# EasyEDA Pro project remo-v0.8.0-rc2-a.epro, schematic Schematic1_5

## Sheets
1 main: Board Name: tf_mux-v1.0.1-a; Create Date: 2025-06-03; Page Name: main; Project Name: sd_mux; Schematic Name: Schematic1_5; Update Date: 2025-06-04; Company: 嘉立创EDA; Page Size: A4; Version: V1.0
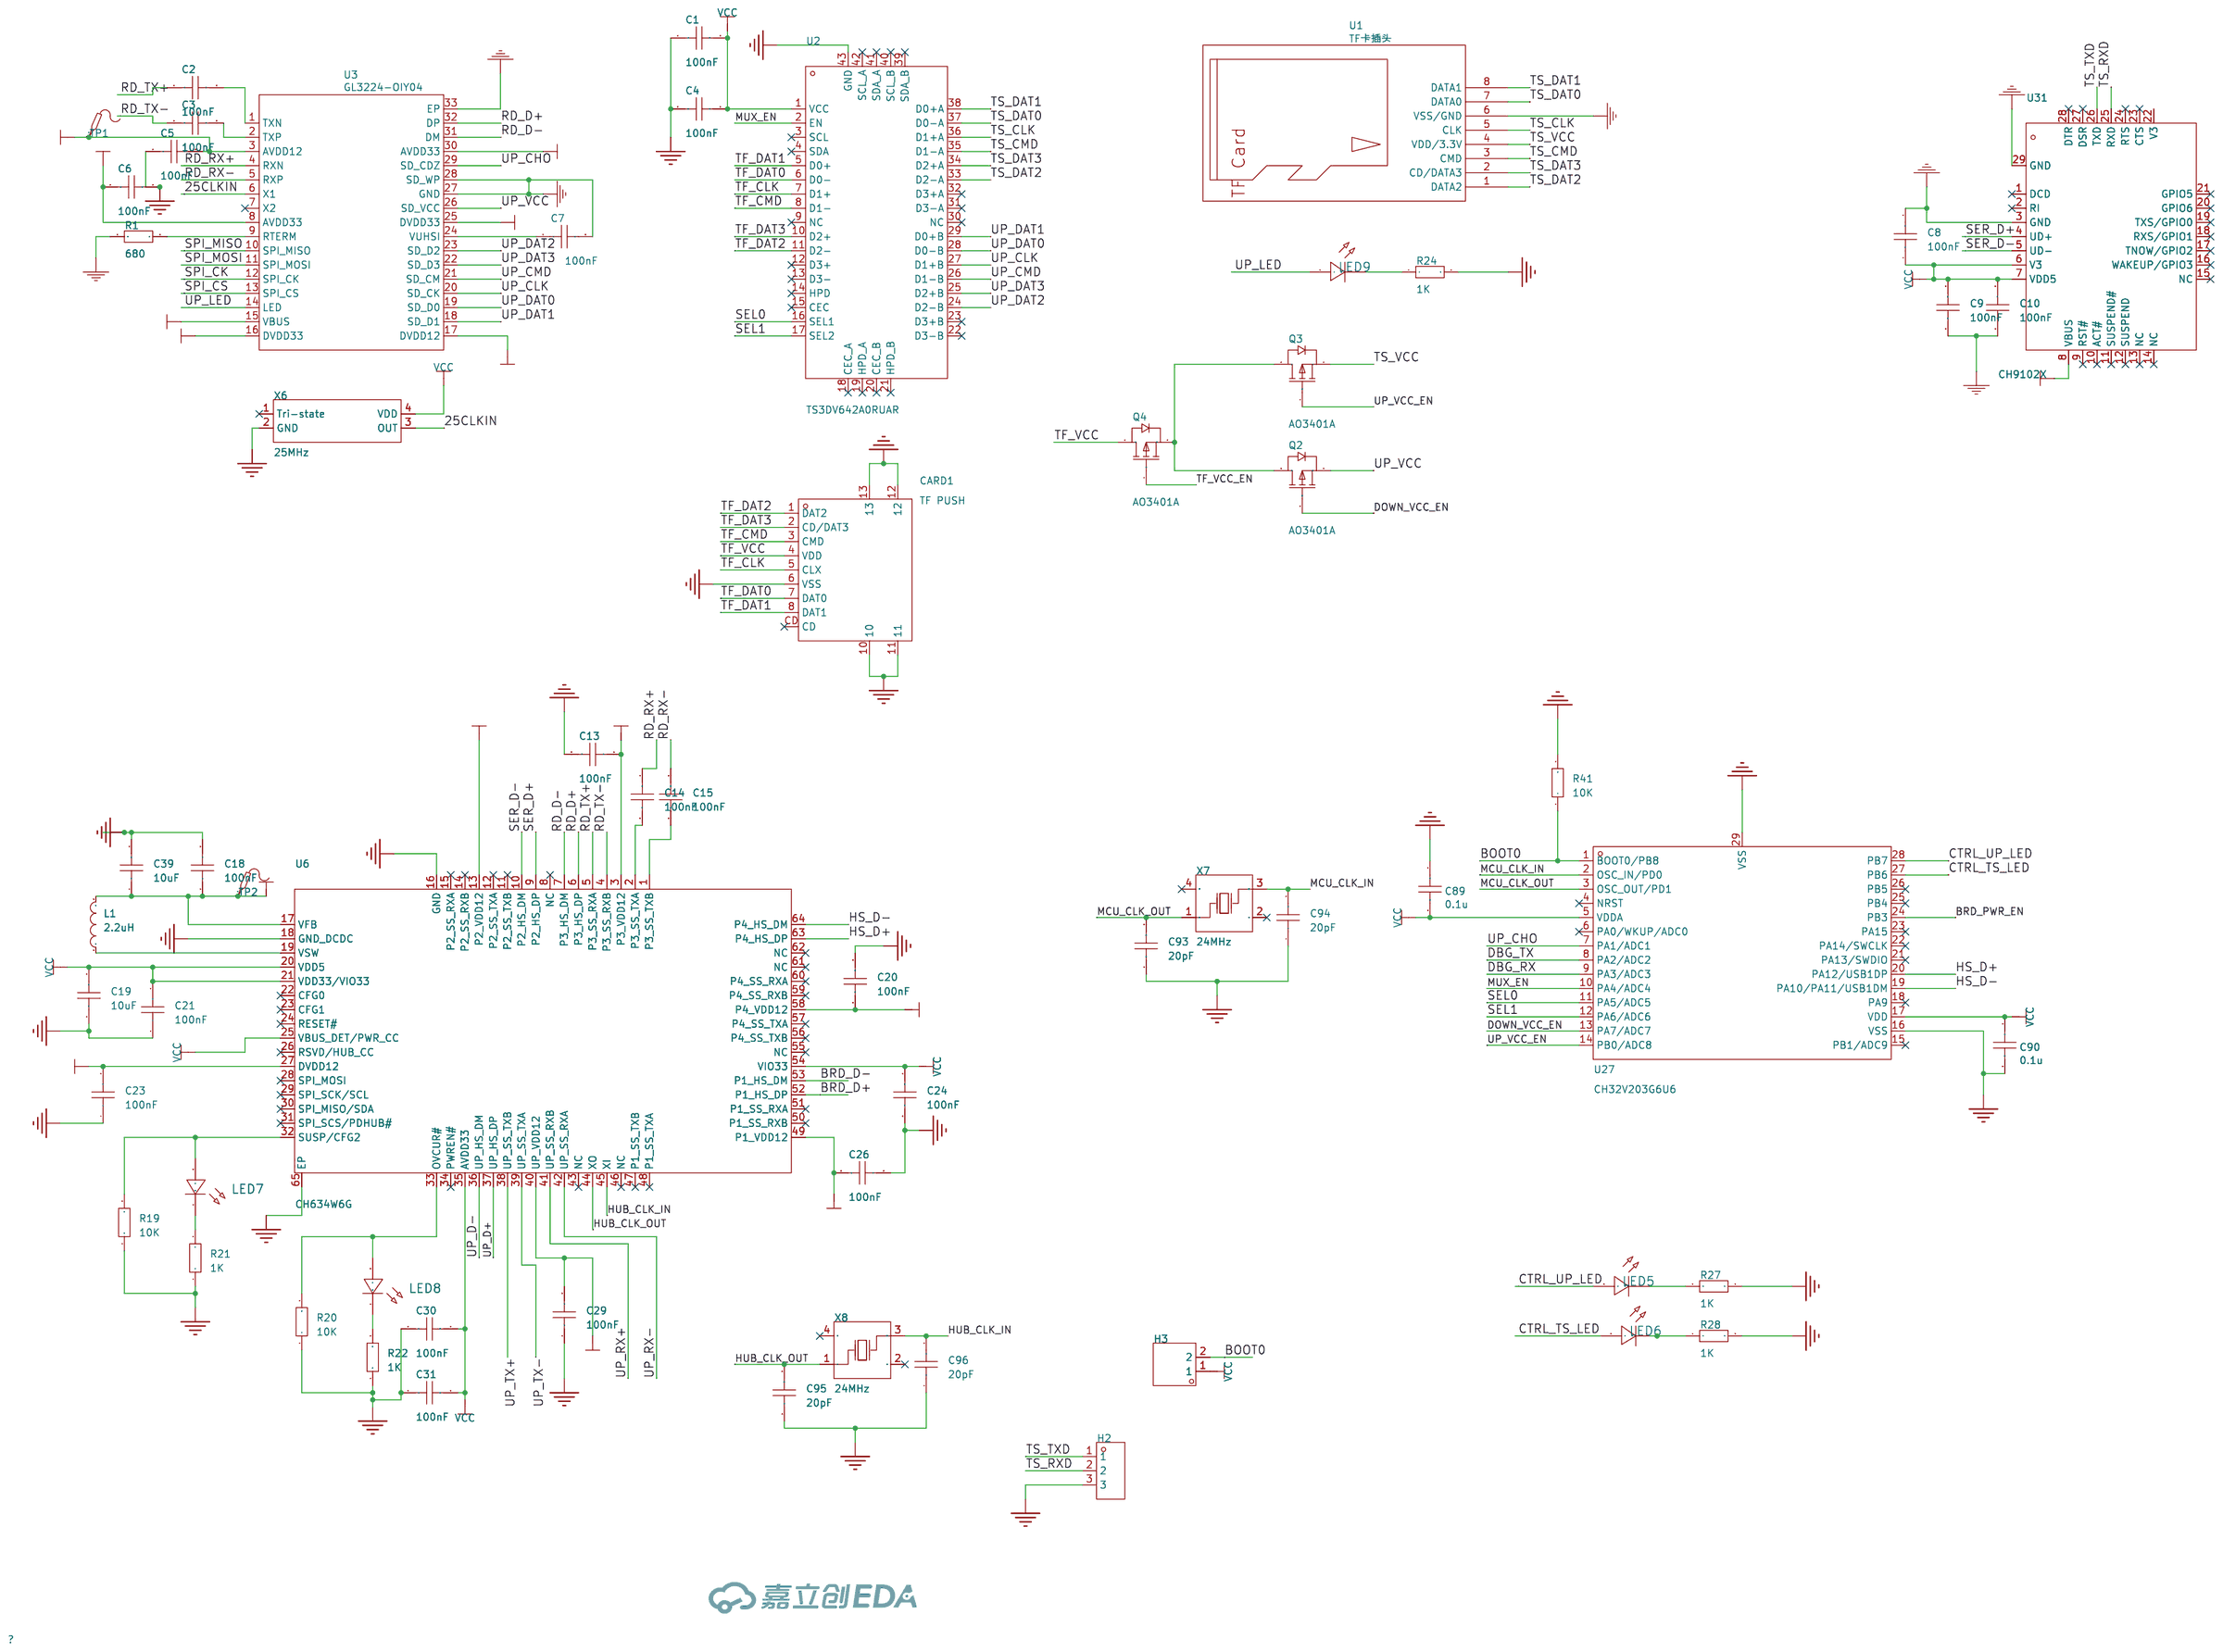
[diagram p0: main]
2 typec_pwr: Board Name: TF_MUX_v1.0.0-a; Create Date: 2025-05-07; Page Name: typec_pwr; Schematic Name: Schematic1_3; Update Date: 2025-05-07
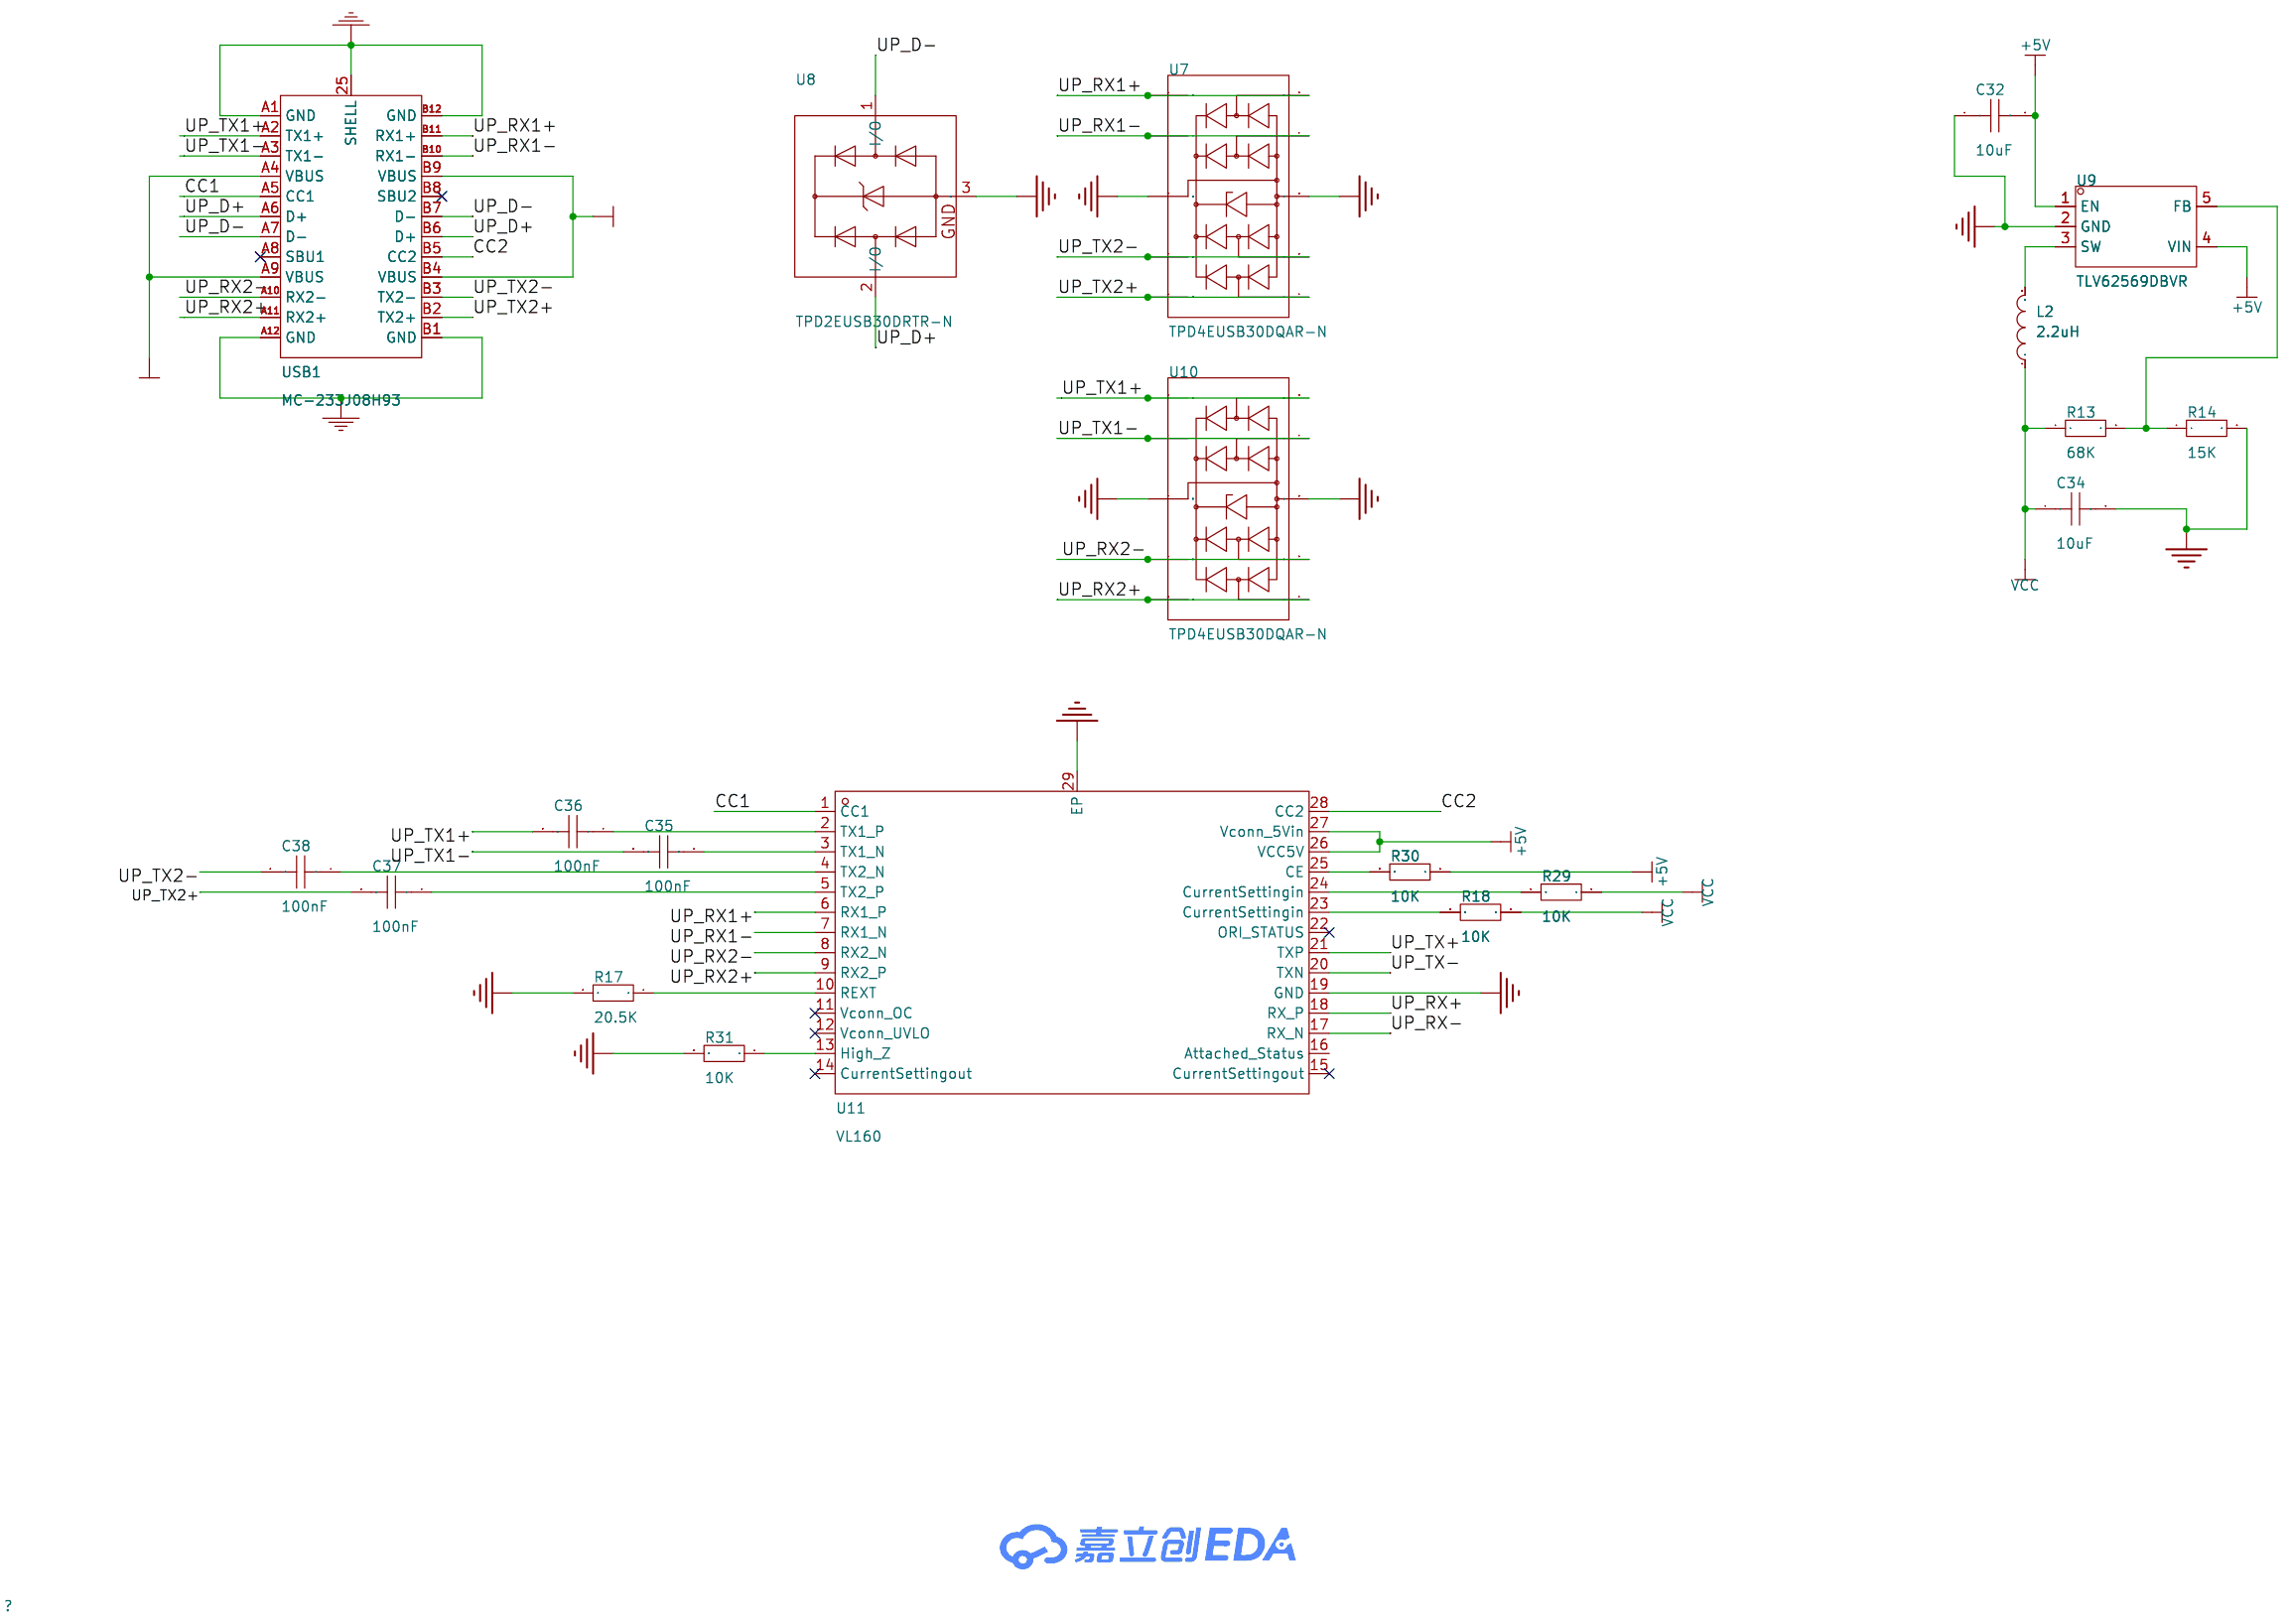
[diagram p1: typec_pwr]
3 power_ctrl: Create Date: 2025-06-05; Page Name: power_ctrl; Update Date: 2025-06-05
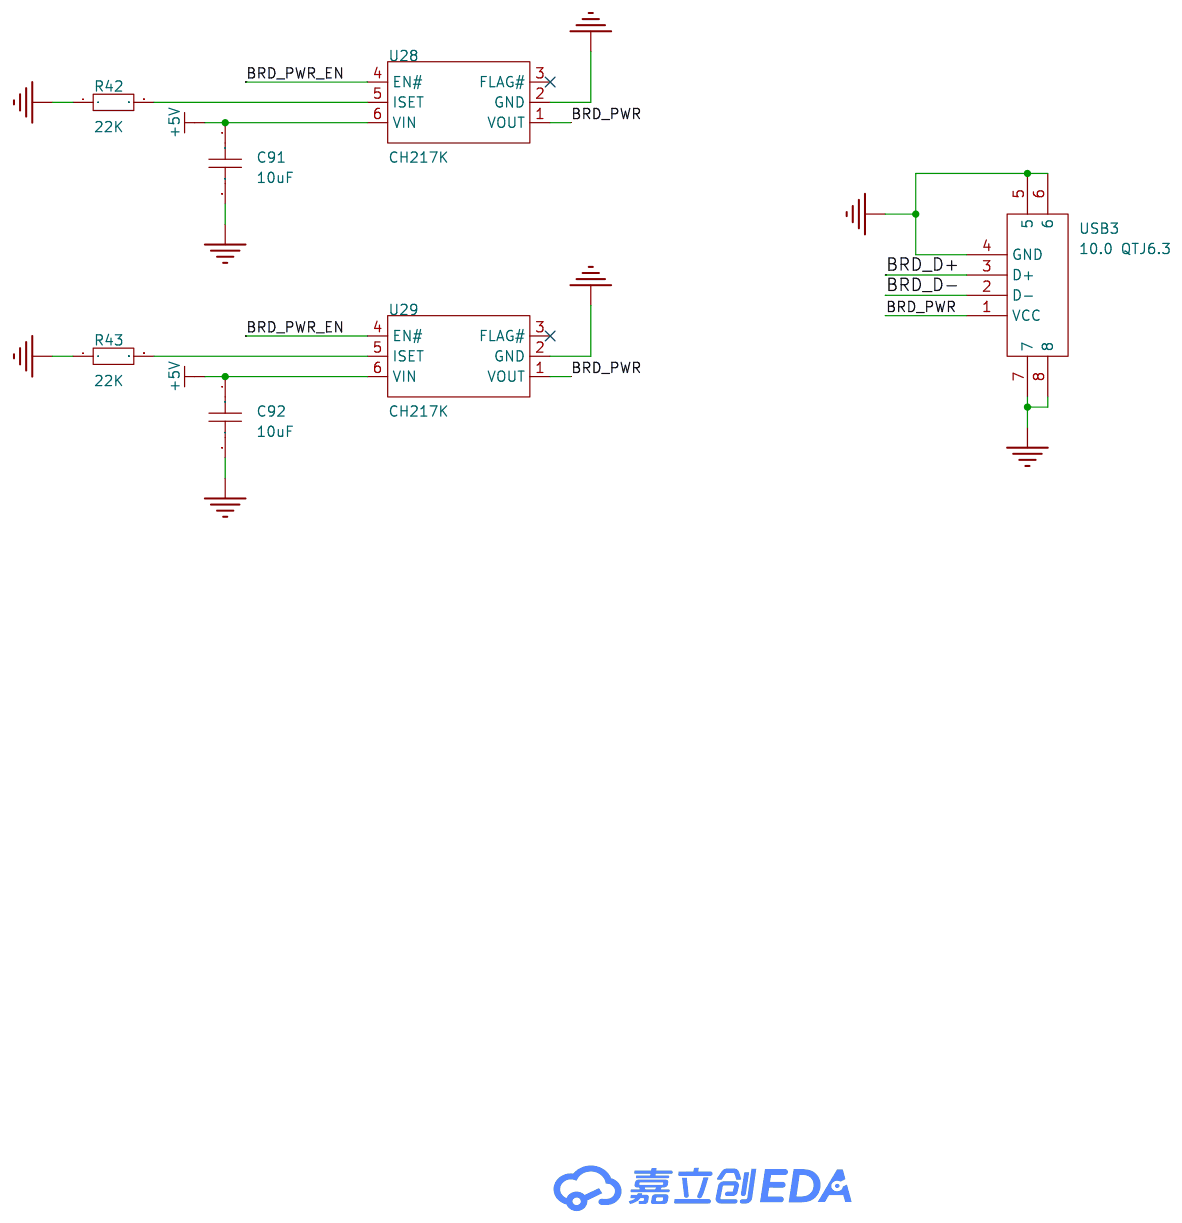
[diagram p2: power_ctrl]

## Parts
sheet main
C1  100nF  [C0402]
C2  100nF  [C0402]
C3  100nF  [C0402]
C4  100nF  [C0402]
C5  100nF  [C0402]
C6  100nF  [C0402]
C7  100nF  [C0402]
C8  100nF  [C0402]
C9  100nF  [C0402]
C10  100nF  [C0402]
C13  100nF  [C0402]
C14  100nF  [C0402]
C15  100nF  [C0402]
C18  100nF  [C0402]
C19  10uF  [C0402]
C20  100nF  [C0402]
C21  100nF  [C0402]
C23  100nF  [C0402]
C24  100nF  [C0402]
C26  100nF  [C0402]
C29  100nF  [C0402]
C30  100nF  [C0402]
C31  100nF  [C0402]
C39  10uF  [C0402]
C89  0.1u  [C0402]
C90  0.1u  [C0402]
C93  20pF  [C0402]
C94  20pF  [C0402]
C95  20pF  [C0402]
C96  20pF  [C0402]
CARD1  TF PUSH  [TF-SMD_TF-PUSH]
H2  -  [HDR-TH_3P-P2.54-V-M]  (no BOM)
H3  -  [HDR-TH_2P-P2.54-V-M-1]  (no BOM)
L1  2.2uH  [IND-SMD_L2.5-W2.0_MHCHL2520]
LED5  -  [LED_0603]
LED6  -  [LED_0603]
LED7  -  [LED_0603]
LED8  -  [LED_0603]
LED9  -  [LED_0603]
Q2  AO3401A  [SOT-23_L2.9-W1.3-P1.90-LS2.4-BR]
Q3  AO3401A  [SOT-23_L2.9-W1.3-P1.90-LS2.4-BR]
Q4  AO3401A  [SOT-23_L2.9-W1.3-P1.90-LS2.4-BR]
R1  680  [R0603]
R19  10K  [R0402]
R20  10K  [R0402]
R21  1K  [R0402]
R22  1K  [R0402]
R24  1K  [R0402]
R27  1K  [R0402]
R28  1K  [R0402]
R41  10K  [R0603]
TP1  -  [Test-Point-0.5mm]
TP2  -  [Test-Point-0.5mm]
U1  TF卡插头  [TF卡封装]  (no BOM)
U2  TS3DV642A0RUAR  [WFQFN-42_L9.0-W3.5-P0.50-BL-EP]
U3  GL3224-OIY04  [HQFN-32_L5.0-W5.0-P0.50-BL-EP3.0]
U6  CH634W6G  [QFN-64_L8.0-W8.0-P0.40-TL-EP6.2]
U27  CH32V203G6U6  [QFN-28_L4.0-W4.0-P0.40-BL-EP2.7]
U31  CH9102X  [TQFN-28_L5.0-W5.0-P0.50-BL-EP2.7]
X6  25MHz  [OSC-SMD_4P-L2.5-W2.0-BL-1]  (no BOM)
X7  24MHz  [CRYSTAL-SMD_4P-L3.2-W2.5-BL]
X8  24MHz  [CRYSTAL-SMD_4P-L3.2-W2.5-BL]
sheet power_ctrl
C91  10uF  [C0603]  (no BOM)
C92  10uF  [C0603]  (no BOM)
R42  22K  [R0603]  (no BOM)
R43  22K  [R0603]  (no BOM)
U28  CH217K  [SOT-23-6_L2.9-W1.6-P0.95-LS2.8-BL]
U29  CH217K  [SOT-23-6_L2.9-W1.6-P0.95-LS2.8-BL]  (no BOM)
USB3  10.0 QTJ6.3  [USB-A-SMD_10.0-QTJ6.3]
sheet typec_pwr
C32  10uF  [C0402]
C34  10uF  [C0402]
C35  100nF  [C0402]
C36  100nF  [C0402]
C37  100nF  [C0402]
C38  100nF  [C0402]
L2  2.2uH  [IND-SMD_L2.5-W2.0_MHCHL2520]
R13  68K  [R0603]
R14  15K  [R0603]
R17  20.5K  [R0603]
R18  10K  [R0402]
R29  10K  [R0402]
R30  10K  [R0402]
R31  10K  [R0402]
U7  TPD4EUSB30DQAR-N  [DFN-10_L2.5-W1.0-P0.50-BL-A]
U8  TPD2EUSB30DRTR-N  [SOT-723_L1.2-W0.8-P0.40-LS1.2-BR]
U9  TLV62569DBVR  [SOT-23-5_L3.0-W1.7-P0.95-LS2.8-BR]
U10  TPD4EUSB30DQAR-N  [DFN-10_L2.5-W1.0-P0.50-BL-A]
U11  VL160  [MQFN-28_L4.5-W3.5-P0.40-BL-EP]
USB1  MC-233J08H93  [USB-C-SMD_TYPE-C-31-M-20]

## Library data of the parts
C1-C10 C13-C15 C18-C21 C23 C24 C26 C29-C32 C34-C39 = CAP_0402: Supplier Footprint: 0402
C89 C90 = 0.1u
C91-C96 = CAP_0603: Supplier Footprint: 0603
CARD1 = TF PUSH: 卡连接方式:自弹式;卡类型:MicroSD卡(TF卡);连接器类型:卡座;本体最大高度:2mm;工作温度范围:-20℃~+90℃;; LCSC Part Name: 自弹式 MicroSD卡(TF卡) 卡座; Supplier Part: C393941; Manufacturer: SHOU HAN(首韩); Supplier Footprint: SMD; JLCPCB Part Class: 扩展库; Datasheet: https://atta.szlcsc.com/upload/public/pdf/source/20191011/C393941_0DDD896EE907FEB750D8B7B8982E2A67.pdf; Supplier: LCSC; Card Connection Mode: 自弹式; Card Type: MicroSD卡(TF卡); Connector Type: 卡座; Additional Card Detection Pins: 无; Maximum Body Height: 2mm; Operating Temperature Range: -20℃~+90℃
H2 = HDR-M_2.54_1x3P: Supplier Part: C2937625; Supplier Footprint: 插件
H3 = HDR-M_2.54_1x2P: Supplier Part: C124375; Supplier Footprint: 插件
L1 L2 = FTC252012S2R2MBCA: 电感值:2.2uH;精度:±20%;额定电流:3A;饱和电流(Isat):3.8A;类型:一体成型电感;; LCSC Part Name: 2.2uH ±20% 3.8A; Supplier Part: C5832372; Manufacturer: cjiang(长江微电); Supplier Footprint: 1008; JLCPCB Part Class: 扩展库; Datasheet: https://atta.szlcsc.com/upload/public/pdf/source/20230602/8FFEDA9C0247A92A0D4B67554BFE4091.pdf; Supplier: LCSC; Tolerance: ±20%; Rated Current: 3A; Saturation Current (Isat): 3.8A; DC Resistance (DCR): 55mΩ; Type: 一体成型电感
LED5-LED9 = LED_0603-R: Supplier Footprint: 0603
Q2-Q4 = AO3401A_C15127: 类型:1个P沟道;漏源电压(Vdss):30V;连续漏极电流(Id):4A;导通电阻(RDS(on)@Vgs,Id):44mΩ@10V,4.3A;功率(Pd):1.4W;阈值电压(Vgs(th)@Id):1.3V@250uA;; LCSC Part Name: 1个P沟道 耐压:30V 电流:4A; Supplier Part: C15127; Manufacturer: AOS; Supplier Footprint: SOT-23; JLCPCB Part Class: 基础库; Datasheet: https://atta.szlcsc.com/upload/public/pdf/source/20160507/1462613609053.pdf; Supplier: LCSC; Type: 1个P沟道; Drain Source Voltage (Vdss): 30V; Continuous Drain Current (Id): 4A; Drain Source On Resistance (RDS(on)@Vgs,Id): 44mΩ@10V,4.3A; Power Dissipation (Pd): 1.4W; Gate Threshold Voltage (Vgs(th)@Id): 1.3V@250uA; Total Gate Charge (Qg@Vgs): 12.2nC@4.5V; Input Capacitance (Ciss@Vds): 1.2nF@15V; Operating Temperature: -55℃~+150℃@(Tj)
R1 R13 R14 R17 R41-R43 = Res_0603: Supplier Footprint: 0603
R18-R22 R24 R27-R31 = Res_0402: Supplier Footprint: 0402
TP1 TP2 = Test-Point: Test Point 测试点; Check: false
U1 = TF卡插头: Supplier: HeZo
U2 = TS3DV642A0RUAR: 开关电路:单刀双掷(SPDT);通道数:12;导通电阻(Ron@VCC):9.5Ω;; LCSC Part Name: 具有1.8V兼容控制和断电模式的12通道1:2多路复用器/多路解复用器; Supplier Part: C157482; Manufacturer: TI(德州仪器); Supplier Footprint: WFQFN-42-EP(3.5x9); JLCPCB Part Class: 扩展库; Datasheet: https://www.ti.com/cn/lit/gpn/ts3dv642; Supplier: LCSC; Switch Circuit: 单刀双掷(SPDT); Number of Channels: 12; Supply Voltage: 2.6V~4.5V; Turn-on time: 100ns; On-State Resistance (Max): 9.5Ω; Operating Temperature: -40℃~+85℃
U3 = GL3224-OIY04: Supplier: LCSC; Supplier Part: C157357; Manufacturer: GENESYS(创惟); JLCPCB Part Class: Extended Part
U6 = CH634W6G: 工业级4端口USB3.0超高速HUB芯片，符合USB3.2 Gen1协议规范，兼容USB2.0。内置PD控制器，支持Type-C快充。支持整体过流检测和电源控制，内置EEPROM信息配置，支持PDHUB 100W、Type-C 15W和BC快充。; Supplier Part: C45986779; Manufacturer: WCH(南京沁恒); Supplier Footprint: QFN-64-EP(8x8); JLCPCB Part Class: 扩展库; Datasheet: https://atta.szlcsc.com/upload/public/pdf/source/20250227/7AD0E05704B18E033392A25CBB5388D5.pdf; Supplier: LCSC
U27 = CH32V203G6U6: CPU内核:RISC-V;GPIO端口数量:-;工作电压范围:-;CPU最大主频:-;程序存储器类型:-;应用领域:-;; Supplier Part: C5142280; Manufacturer: WCH(南京沁恒); Supplier Footprint: QFN28X4; JLCPCB Part Class: 扩展库; Datasheet: https://atta.szlcsc.com/upload/public/pdf/source/20230523/1B381532B53560847D0152FAE396CF1C.pdf; Supplier: LCSC; CPU Core: RISC-V
U31 = CH9102X_C5187522: 应用功能:USB转UART;接口协议:USB 2.0;通道数:-;数据速率:4Mbps;; LCSC Part Name: USB转串口芯片CH9102; Supplier Part: C5187522; Manufacturer: WCH(南京沁恒); Supplier Footprint: QFN-28(5x5); JLCPCB Part Class: 扩展库; Datasheet: https://atta.szlcsc.com/upload/public/pdf/source/20240313/AF0D9A0C8A705CD7DAC68F5AA4A0187A.pdf; Supplier: LCSC; Applications Function: USB转UART; Protocol: USB 2.0; Supply Voltage: 3.3V; Data Rate: 4Mbps; Operating Temperature: -40℃~+85℃
X6 = OT252025MJBA4SL: 频率:25MHz;常温频差:±10ppm;输出模式:CMOS;工作电压:1.8V~3.3V;频率稳定度:±20ppm;; LCSC Part Name: 25MHz ±10ppm 1.8V~3.3V YSO110TR; Supplier Part: C717683; Manufacturer: YXC(扬兴晶振); Supplier Footprint: SMD2520-4P; JLCPCB Part Class: 扩展库; Datasheet: https://atta.szlcsc.com/upload/public/pdf/source/20240731/596E5F7673E50DA744B7F79F139FB8DF.pdf; Supplier: LCSC; Normal temperature Frequency Tolerance: ±10ppm; Output Type: CMOS; Voltage - Supply: 1.8V~3.3V; Frequency Stability: ±20ppm; Operating Temperature: -40℃~+85℃
X7 X8 = X322524MSB4SI: 晶振类型:贴片无源晶振;频率:24MHz;频率公差:±10ppm;频率稳定度:±30ppm;负载电容:20pF;工作温度:-40℃~+85℃;; LCSC Part Name: YSX321SL 24MHz ±10ppm 20pF; Supplier Part: C15643; Manufacturer: YXC(扬兴科技); Supplier Footprint: SMD3225-4P; JLCPCB Part Class: Extended Part; Datasheet: https://atta.szlcsc.com/upload/public/pdf/source/20210329/C112971_1F611BDC486E193C1706F6D8EB5AA189.pdf; Supplier: LCSC; Crystal Type: 贴片无源晶振; Frequency Tolerance: ±10ppm; Frequency Stability: ±30ppm; Load Capacitance: 20pF; Operating Temperature: -40℃~+85℃
U28 U29 = CH217K: 类型:负载开关;通道数:1;输入控制逻辑:低电平有效;输出电流:2.7A;工作电压:2.7V~5.5V;导通电阻:70mΩ;; LCSC Part Name: USB 限流配电开关芯片; Supplier Part: C7462749; Manufacturer: WCH(南京沁恒); Supplier Footprint: SOT-23-6; JLCPCB Part Class: 扩展库; Datasheet: https://atta.szlcsc.com/upload/public/pdf/source/20240614/C0960F2CAA1F151A0DBC53501BDEDFC6.pdf; Supplier: LCSC; Type: 负载开关; Number of Channels: 1; Control Input Logic: 低电平有效; Output Current: 2.7A; Voltage - Supply: 2.7V~5.5V; RDS(on): 70mΩ; Operating Temperature	-: -40℃~+85℃
USB3 = 10.0 QTJ6.3: 连接器类型:Type-A;标准:USB 2.0;公母:母;安装方式:卧贴;触点数量:4P;端口数量:1;额定电流 - 电源:1.5A;工作温度范围:-25℃~+85℃;; LCSC Part Name: Type-A 母 卧贴; Supplier Part: C404966; Manufacturer: SHOU HAN(首韩); Supplier Footprint: SMD; JLCPCB Part Class: 扩展库; Datasheet: https://atta.szlcsc.com/upload/public/pdf/source/20241125/0CEA21D77C128715D5877707589FFAD8.pdf; Supplier: LCSC; Connector Type: Type-A; Standard: USB 2.0; Gender: 母; Mounting Style: 卧贴; Number of Contacts: 4P; Number of Ports: 1; Current Rating - Power (Max): 1.5A; Rated Voltage (Max): 30V; Connect-Disconnect Life: 5千次; Length: 10mm; Core Colour: 黑色; Operating Temperature Range: -25℃~+85℃
U7 U10 = TPD4EUSB30DQAR-N: 极性:单向;反向截止电压(Vrwm):5V;; LCSC Part Name: TVS二极管(ESD); Supplier Part: C5148477; Manufacturer: BORN(伯恩半导体); Supplier Footprint: DFN-10L; JLCPCB Part Class: 扩展库; Datasheet: https://atta.szlcsc.com/upload/public/pdf/source/20220914/C5B302F271DD41F07FF0824DC250FA50.pdf; Supplier: LCSC; polarity: 单向; Reverse Stand-Off Voltage (Vrwm): 5V
U8 = TPD2EUSB30DRTR-N: 极性:单向;反向截止电压(Vrwm):5V;; Supplier Part: C6165119; Manufacturer: BORN(伯恩半导体); Supplier Footprint: SOT-9X3; JLCPCB Part Class: 扩展库; Datasheet: https://atta.szlcsc.com/upload/public/pdf/source/20230523/3540546399F5B172360969C971DB8F29.pdf; Supplier: LCSC; Polarity: 单向; Reverse Stand-Off Voltage (Vrwm): 5V; Type: ESD
U9 = TLV62569DBVR: 功能类型:降压型;输出类型:可调;工作电压:2.5V~5.5V;输出电压:600mV~5.5V;输出电流:2A;; LCSC Part Name: 高效率同步降压转换器; Supplier Part: C141836; Manufacturer: TI(德州仪器); Supplier Footprint: SOT-23-5; JLCPCB Part Class: 扩展库; Datasheet: https://www.ti.com/cn/lit/gpn/tlv62569; Supplier: LCSC; Function: 降压型; Output Type: 可调; Input Voltage: 2.5V~5.5V; Output Voltage: 600mV~5.5V; Output Current: 2A; Switching Frequency: 1.5MHz; Operating Temperature: -40℃~+125℃@(TJ); Synchronous Rectification: 是; Topology: 降压式; Switch tube (built-in/external): 内置
U11 = VL160: 应用功能:-;接口协议:-;; Supplier Part: C2841472; Supplier Footprint: MQFN-28-EP(3.5x4.5); JLCPCB Part Class: 扩展库; Datasheet: https://atta.szlcsc.com/upload/public/pdf/source/20210707/C2841472_23203D4DC0B460F77735B81667EEBB6C.pdf; Supplier: LCSC
USB1 = MC-233J08H93: 连接器类型:Type-C;标准:USB 3.1;公母:母;端口数量:1;触点数量:24P;安装方式:夹板;额定电流 - 电源:5A;触头材质:-;触头镀层:-;工作温度范围:-25℃~+85℃;焊接温度(最大值):-;; LCSC Part Name: Type-C 母 夹板; Supplier Part: C3039310; Manufacturer: HANBO(汉博); Supplier Footprint: SMD; JLCPCB Part Class: 扩展库; Datasheet: https://atta.szlcsc.com/upload/public/pdf/source/20221111/B4F254868FFB29F45126513D1A8046E4.pdf; Supplier: LCSC; Connector Type: Type-C; Standard: USB 3.1; Gender: 母; Number of Ports: 1; Number of Contacts: 24P; Mounting Style: 夹板; Current Rating - Power (Max): 5A; Operating Temperature Range: -25℃~+85℃

## Nets
+5V: C32.2 C91.1 C92.1 R30.1 U9.1(EN) U9.4(VIN) U11.26(VCC5V) U11.27(Vconn_5Vin) U28.6(VIN) U29.6(VIN) U31.8(VBUS) USB1.A4(VBUS) USB1.A9(VBUS) USB1.B4(VBUS) USB1.B9(VBUS)
GND: C1.1 C4.1 C5.1 C6.2 C7.2 C8.2 C9.1 C10.1 C13.2 C18.2 C19.1 C20.2 C21.1 C23.1 C24.2 C26.1 C29.1 C30.1 C31.1 C32.1 C34.2 C39.2 C89.1 C90.2 C91.2 C92.2 C93.1 C94.1 C95.1 C96.1 CARD1.6(VSS) CARD1.10 CARD1.11 CARD1.12 CARD1.13 H2.3 R1.1 R14.2 R17.2 R19.1 R20.1 R21.1 R22.1 R24.2 R27.2 R28.2 R31.2 R41.2 R42.1 R43.1 U1.6(VSS/GND) U2.43(GND) U3.27(GND) U3.28(SD_WP) U3.33(EP) U6.16(GND) U6.18(GND_DCDC) U6.65(EP) U7.3 U7.8 U8.3(GND) U9.2(GND) U10.3 U10.8 U11.19(GND) U11.29(EP) U27.16(VSS) U27.29(VSS) U28.2(GND) U29.2(GND) U31.3(GND) U31.29(GND) USB1.25(SHELL) USB1.A1(GND) USB1.A12(GND) USB1.B1(GND) USB1.B12(GND) USB3.4(GND) USB3.5 USB3.6 USB3.7 USB3.8 X6.2(GND)
VCC: C1.2 C4.2 C6.1 C8.1 C9.2 C10.2 C19.2 C21.2 C24.1 C30.2 C31.2 C34.1 C89.2 C90.1 H3.1 L2.1 R13.1 R18.1 R29.1 U2.1(VCC) U3.8(AVDD33) U3.15(VBUS) U3.16(DVDD33) U3.25(DVDD33) U3.30(AVDD33) U6.20(VDD5) U6.21(VDD33/VIO33) U6.25(VBUS_DET/PWR_CC) U6.35(AVDD33) U6.54(VIO33) U27.5(VDDA) U27.17(VDD) U31.6(V3) U31.7(VDD5) X6.4(VDD)
25CLKIN: U3.6(X1) X6.3(OUT)
BOOT0: H3.2 R41.1 U27.1(BOOT0/PB8)
BRD_D+: U6.52(P1_HS_DP) USB3.3(D+)
BRD_D-: U6.53(P1_HS_DM) USB3.2(D-)
BRD_PWR: U28.1(VOUT) U29.1(VOUT) USB3.1(VCC)
BRD_PWR_EN: U27.24(PB3) U28.4(EN#) U29.4(EN#)
CC1: U11.1(CC1) USB1.A5(CC1)
CC2: U11.28(CC2) USB1.B5(CC2)
CTRL_TS_LED: LED6.2(A) U27.27(PB6)
CTRL_UP_LED: LED5.2(A) U27.28(PB7)
DBG_RX: U27.9(PA3/ADC3)
DBG_TX: U27.8(PA2/ADC2)
DOWN_VCC_EN: Q2.1(G) U27.13(PA7/ADC7)
HS_D+: U6.63(P4_HS_DP) U27.20(PA12/USB1DP)
HS_D-: U6.64(P4_HS_DM) U27.19(PA10/PA11/USB1DM)
HUB_CLK_IN: C96.2 U6.45(XI) X8.3(OSC2)
HUB_CLK_OUT: C95.2 U6.44(XO) X8.1(OSC1)
MCU_CLK_IN: C94.2 U27.2(OSC_IN/PD0) X7.3(OSC2)
MCU_CLK_OUT: C93.2 U27.3(OSC_OUT/PD1) X7.1(OSC1)
MUX_EN: U2.2(EN) U27.10(PA4/ADC4)
RD_1V2: C5.2 TP1.1 U3.3(AVDD12) U3.17(DVDD12)
RD_D+: U3.32(DP) U6.6(P3_HS_DP)
RD_D-: U3.31(DM) U6.7(P3_HS_DM)
RD_RX+: C14.1 U3.4(RXN)
RD_RX-: C15.1 U3.5(RXP)
RD_TX+: C2.1 U6.5(P3_SS_RXA)
RD_TX-: C3.1 U6.4(P3_SS_RXB)
SEL0: U2.16(SEL1) U27.11(PA5/ADC5)
SEL1: U2.17(SEL2) U27.12(PA6/ADC6)
SER_D+: U6.9(P2_HS_DP) U31.4(UD+)
SER_D-: U6.10(P2_HS_DM) U31.5(UD-)
SPI_CK: U3.12(SPI_CK)
SPI_CS: U3.13(SPI_CS)
SPI_MISO: U3.10(SPI_MISO)
SPI_MOSI: U3.11(SPI_MOSI)
TF_1V2: C13.1 C18.1 C20.1 C23.2 C26.2 C29.2 C39.1 L1.2 TP2.1 U6.3(P3_VDD12) U6.13(P2_VDD12) U6.17(VFB) U6.27(DVDD12) U6.40(UP_VDD12) U6.49(P1_VDD12) U6.58(P4_VDD12)
TF_CLK: CARD1.5(CLX) U2.7(D1+)
TF_CMD: CARD1.3(CMD) U2.8(D1-)
TF_DAT0: CARD1.7(DAT0) U2.6(D0-)
TF_DAT1: CARD1.8(DAT1) U2.5(D0+)
TF_DAT2: CARD1.1(DAT2) U2.11(D2-)
TF_DAT3: CARD1.2(CD/DAT3) U2.10(D2+)
TF_VCC: CARD1.4(VDD) Q4.3(D)
TF_VCC_EN: Q4.1(G)
TS_CLK: U1.5(CLK) U2.36(D1+A)
TS_CMD: U1.3(CMD) U2.35(D1-A)
TS_DAT0: U1.7(DATA0) U2.37(D0-A)
TS_DAT1: U1.8(DATA1) U2.38(D0+A)
TS_DAT2: U1.1(DATA2) U2.33(D2-A)
TS_DAT3: U1.2(CD/DATA3) U2.34(D2+A)
TS_RXD: H2.2 U31.25(RXD)
TS_TXD: H2.1 U31.26(TXD)
TS_VCC: Q3.2(S) U1.4(VDD/3.3V)
UP_CHO: U3.29(SD_CDZ) U27.7(PA1/ADC1)
UP_CLK: U2.27(D1+B) U3.20(SD_CK)
UP_CMD: U2.26(D1-B) U3.21(SD_CM)
UP_D+: U6.37(UP_HS_DP) U8.2(I/O) USB1.A6(D+) USB1.B6(D+)
UP_D-: U6.36(UP_HS_DM) U8.1(I/O) USB1.A7(D-) USB1.B7(D-)
UP_DAT0: U2.28(D0-B) U3.19(SD_D0)
UP_DAT1: U2.29(D0+B) U3.18(SD_D1)
UP_DAT2: U2.24(D2-B) U3.23(SD_D2)
UP_DAT3: U2.25(D2+B) U3.22(SD_D3)
UP_LED: LED9.2(A) U3.14(LED)
UP_RX1+: U7.5 U7.6 U11.6(RX1_P) USB1.B11(RX1+)
UP_RX1-: U7.4 U7.7 U11.7(RX1_N) USB1.B10(RX1-)
UP_RX2+: U10.1 U10.10 U11.9(RX2_P) USB1.A11(RX2+)
UP_RX2-: U10.2 U10.9 U11.8(RX2_N) USB1.A10(RX2-)
UP_RX+: U6.41(UP_SS_RXB) U11.18(RX_P)
UP_RX-: U6.42(UP_SS_RXA) U11.17(RX_N)
UP_TX1+: C36.2 U10.5 U10.6 USB1.A2(TX1+)
UP_TX1-: C35.2 U10.4 U10.7 USB1.A3(TX1-)
UP_TX2+: C37.2 U7.1 U7.10 USB1.B2(TX2+)
UP_TX2-: C38.2 U7.2 U7.9 USB1.B3(TX2-)
UP_TX+: U6.38(UP_SS_TXB) U11.21(TXP)
UP_TX-: U6.39(UP_SS_TXA) U11.20(TXN)
UP_VCC: Q2.2(S) U3.26(SD_VCC)
UP_VCC_EN: Q3.1(G) U27.14(PB0/ADC8)
$1N442: R1.2 U3.9(RTERM)
$1N465: C3.2 U3.2(TXP)
$1N466: C2.2 U3.1(TXN)
$1N469: C7.1 U3.24(VUHSI)
$1N1150: LED9.1(C) R24.1
$1N14755: L1.1 U6.19(VSW)
$1N15481: LED7.2(A) R19.2 U6.32(SUSP/CFG2)
$1N15483: LED7.1(C) R21.2
$1N15725: LED8.2(A) R20.2 U6.33(OVCUR#)
$1N15730: LED8.1(C) R22.2
$1N16323: C14.2 U6.2(P3_SS_TXA)
$1N16329: C15.2 U6.1(P3_SS_TXB)
$1N18923: LED5.1(C) R27.1
$1N18990: LED6.1(C) R28.1
$1N32388: Q2.3(D) Q3.3(D) Q4.2(S)
$2N1216: C37.1 U11.5(TX2_P)
$2N1220: C35.1 U11.3(TX1_N)
$2N1225: C36.1 U11.2(TX1_P)
$2N2007: L2.2 U9.3(SW)
$2N2009: R13.2 R14.1 U9.5(FB)
$2N4733: C38.1 U11.4(TX2_N)
$2N4822: R17.1 U11.10(REXT)
$2N4911: R29.2 U11.24(CurrentSettingin)
$2N4915: R18.2 U11.23(CurrentSettingin)
$2N4956: R30.2 U11.25(CE)
$2N5044: R31.1 U11.13(High_Z)
$3N434: R42.2 U28.5(ISET)
$3N443: R43.2 U29.5(ISET)

Not connected (* = marked no-connect by the designer): CARD1 CD*; U2 3(SCL)* 4(SDA)* 9(NC)* 12(D3+)* 13(D3-)* 14(HPD)* 15(CEC)* 18(CEC_A)* 19(HPD_A)* 20(CEC_B)* 21(HPD_B)* 22(D3-B)* 23(D3+B)* 30(NC)* 31(D3-A)* 32(D3+A)* 39(SDA_B)* 40(SCL_B)* 41(SDA_A)* 42(SCL_A)*; U3 7(X2)*; U6 8(NC)* 11(P2_SS_TXB)* 12(P2_SS_TXA)* 14(P2_SS_RXB)* 15(P2_SS_RXA)* 22(CFG0)* 23(CFG1)* 24(RESET#)* 26(RSVD/HUB_CC)* 28(SPI_MOSI)* 29(SPI_SCK/SCL)* 30(SPI_MISO/SDA)* 31(SPI_SCS/PDHUB#)* 34(PWREN#)* 43(NC)* 46(NC)* 47(P1_SS_TXB)* 48(P1_SS_TXA)* 50(P1_SS_RXB)* 51(P1_SS_RXA)* 55(NC)* 56(P4_SS_TXB)* 57(P4_SS_TXA)* 59(P4_SS_RXB)* 60(P4_SS_RXA)* 61(NC)* 62(NC)*; U11 11(Vconn_OC)* 12(Vconn_UVLO)* 14(CurrentSettingout)* 15(CurrentSettingout)* 16(Attached_Status) 22(ORI_STATUS)*; U27 4(NRST)* 6(PA0/WKUP/ADC0)* 15(PB1/ADC9)* 18(PA9)* 21(PA13/SWDIO)* 22(PA14/SWCLK)* 23(PA15)* 25(PB4)* 26(PB5)*; U28 3(FLAG#)*; U29 3(FLAG#)*; U31 1(DCD)* 2(RI)* 9(RST#)* 10(ACT#)* 11(SUSPEND#)* 12(SUSPEND)* 13(NC)* 14(NC)* 15(NC)* 16(WAKEUP/GPIO3)* 17(TNOW/GPIO2)* 18(RXS/GPIO1)* 19(TXS/GPIO0)* 20(GPIO6)* 21(GPIO5)* 22(V3) 23(CTS)* 24(RTS)* 27(DSR)* 28(DTR)*; USB1 A8(SBU1)* B8(SBU2)*; X6 1(Tri-state)*; X7 2(GND)* 4(GND)*; X8 2(GND)* 4(GND)*
